# Altium schematic sheet 12-USB Phy and Hub.SchDoc
size C; SheetNumber: 12; SheetTotal: 20
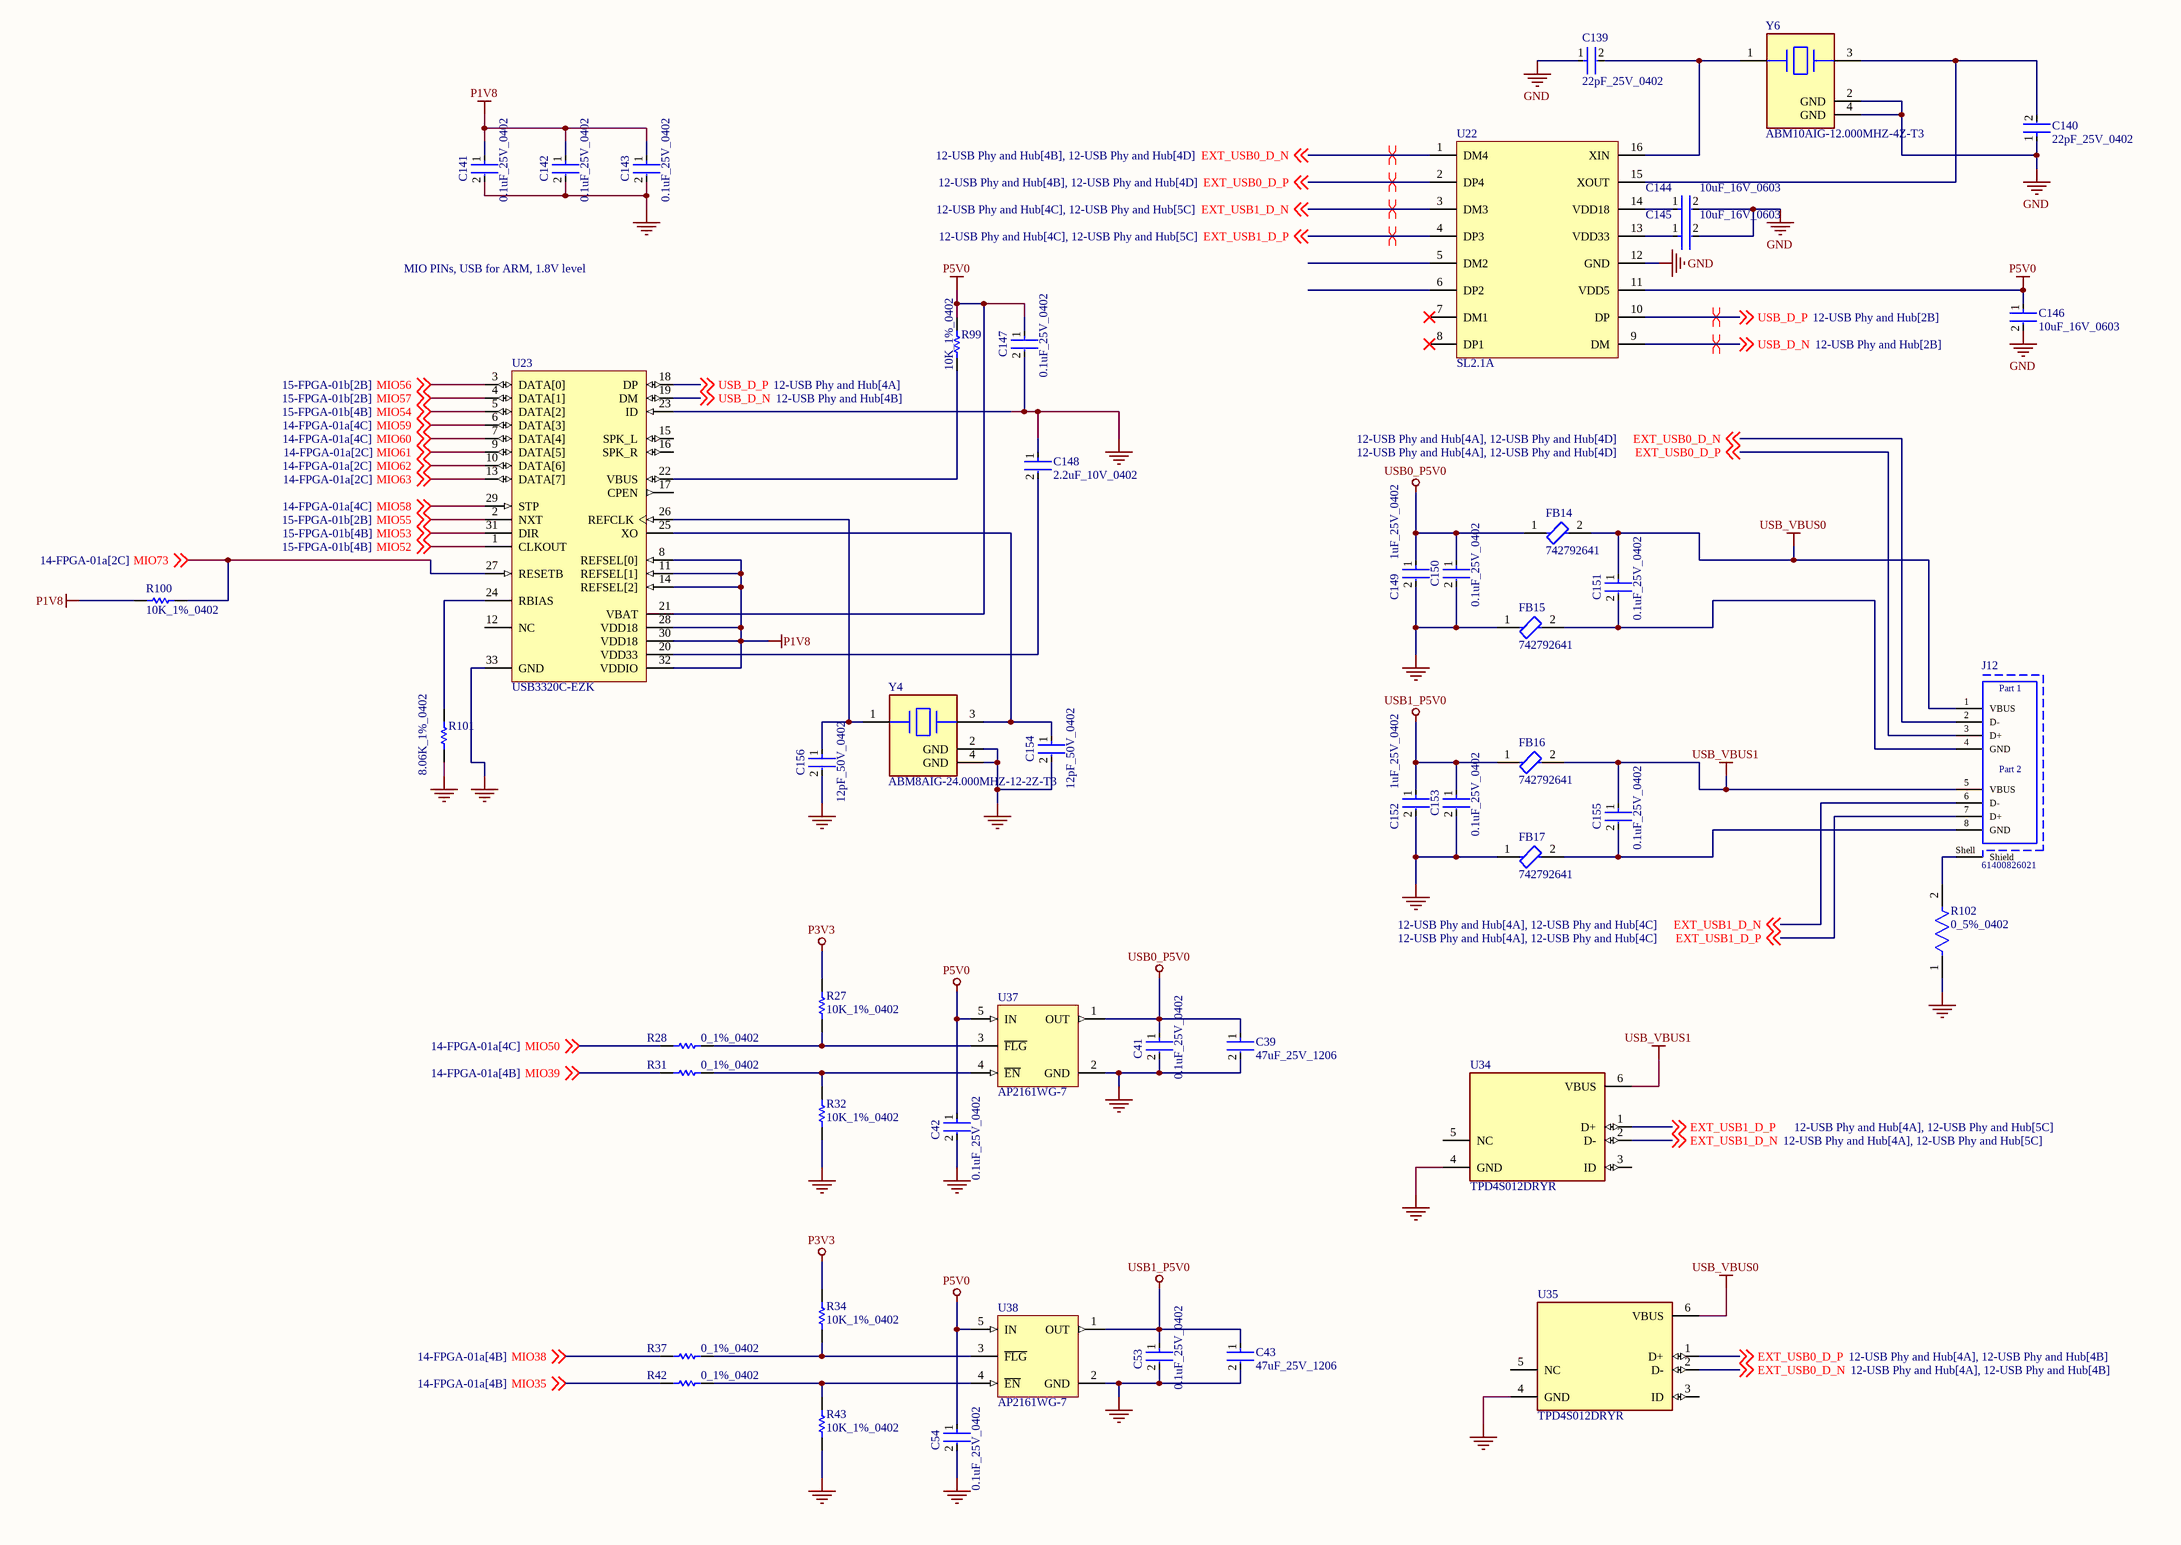
[diagram p0: 12-USB Phy and Hub.SchDoc]

## Parts
C39  47uF_25V_1206  [FP-C3216-160-0_2-MFG]
C41  0.1uF_25V_0402  [FP-0402-L_1_0_1-W_0_5_0_1-IPC_C]
C42  0.1uF_25V_0402  [FP-0402-L_1_0_1-W_0_5_0_1-IPC_C]
C43  47uF_25V_1206  [FP-C3216-160-0_2-MFG]
C53  0.1uF_25V_0402  [FP-0402-L_1_0_1-W_0_5_0_1-IPC_C]
C54  0.1uF_25V_0402  [FP-0402-L_1_0_1-W_0_5_0_1-IPC_C]
C139  22pF_25V_0402  [FP-C0402-BB-MFG]
C140  22pF_25V_0402  [FP-C0402-BB-MFG]
C141  0.1uF_25V_0402  [FP-0402-L_1_0_1-W_0_5_0_1-IPC_C]
C142  0.1uF_25V_0402  [FP-0402-L_1_0_1-W_0_5_0_1-IPC_C]
C143  0.1uF_25V_0402  [FP-0402-L_1_0_1-W_0_5_0_1-IPC_C]
C144  10uF_16V_0603  [FP-0603-L_1_6_0_2-W_0_8_0-MFG]
C145  10uF_16V_0603  [FP-0603-L_1_6_0_2-W_0_8_0-MFG]
C146  10uF_16V_0603  [FP-0603-L_1_6_0_2-W_0_8_0-MFG]
C147  0.1uF_25V_0402  [FP-0402-L_1_0_1-W_0_5_0_1-IPC_C]
C148  2.2uF_10V_0402  [FP-C1005-050-0_15-0_1-MFG]
C149  1uF_25V_0402  [FP-CL542-IPC_C]
C150  0.1uF_25V_0402  [FP-0402-L_1_0_1-W_0_5_0_1-IPC_C]
C151  0.1uF_25V_0402  [FP-0402-L_1_0_1-W_0_5_0_1-IPC_C]
C152  1uF_25V_0402  [FP-CL542-IPC_C]
C153  0.1uF_25V_0402  [FP-0402-L_1_0_1-W_0_5_0_1-IPC_C]
C154  12pF_50V_0402  [FP-0402-L_1_0_1-W_0_5_0_1-IPC_B]
C155  0.1uF_25V_0402  [FP-0402-L_1_0_1-W_0_5_0_1-IPC_C]
C156  12pF_50V_0402  [FP-0402-L_1_0_1-W_0_5_0_1-IPC_B]
FB14  742792641  [FP-742792641-MFG]
FB15  742792641  [FP-742792641-MFG]
FB16  742792641  [FP-742792641-MFG]
FB17  742792641  [FP-742792641-MFG]
J12  61400826021  [61400826021]
R27  10K_1%_0402  [RESC1005X40X25NL10T10]
R28  0_1%_0402  [RESC1005X40X25LL05T05]
R31  0_1%_0402  [RESC1005X40X25LL05T05]
R32  10K_1%_0402  [RESC1005X40X25NL10T10]
R34  10K_1%_0402  [RESC1005X40X25NL10T10]
R37  0_1%_0402  [RESC1005X40X25LL05T05]
R42  0_1%_0402  [RESC1005X40X25LL05T05]
R43  10K_1%_0402  [RESC1005X40X25NL10T10]
R99  10K_1%_0402  [RESC1005X40X25NL10T10]
R100  10K_1%_0402  [RESC1005X40X25NL10T10]
R101  8.06K_1%_0402  [RESC1005X40X25ML05T05]
R102  0_5%_0402  [FP-AC0402-0_37-IPC_B]
U22  SL2.1A  [IC_SL2.1A]
U23  USB3320C-EZK  [MCHP-QFN-32-5x5_V2]
U34  TPD4S012DRYR  [FP-DRY0006A-MFG]
U35  TPD4S012DRYR  [FP-DRY0006A-MFG]
U37  AP2161WG-7  [DIOD-SOT25-5_V]
U38  AP2161WG-7  [DIOD-SOT25-5_V]
Y4  ABM8AIG-24.000MHZ-12-2Z-T3  [FP-ABM8AIG-MFG]
Y6  ABM10AIG-12.000MHZ-4Z-T3  [FP-ABM10AIG-MFG]

## Nets
GND: C39.2 C41.2 C42.2 C43.2 C53.2 C54.2 C139.1 C140.1 C141.2 C142.2 C143.2 C144.2 C145.2 C146.2 C147.2 C148.1 C149.2 C150.2 C152.2 C153.2 C154.2 C156.2 FB15.1 FB17.1 R32.1 R43.1 R101.1 R102.1 U22.12(GND) U23.23(ID) U23.33(GND) U34.4(GND) U35.4(GND) U37.2(GND) U38.2(GND) Y4.2(GND) Y4.4(GND) Y6.2(GND) Y6.4(GND)
P1V8: C141.1 C142.1 C143.1 R100.1 U23.8(REFSEL[0]) U23.11(REFSEL[1]) U23.14(REFSEL[2]) U23.28(VDD18) U23.30(VDD18) U23.32(VDDIO)
P3V3: R27.2 R34.2
P5V0: C42.1 C54.1 C146.1 C147.1 R99.2 U22.11(VDD5) U23.21(VBAT) U37.5(IN) U38.5(IN)
USB0_P5V0: C39.1 C41.1 C149.1 C150.1 FB14.1 U37.1(OUT)
USB1_P5V0: C43.1 C53.1 C152.1 C153.1 FB16.1 U38.1(OUT)
USB_VBUS0: C151.1 FB14.2 J12.1(VBUS) U35.6(VBUS)
USB_VBUS1: C155.1 FB16.2 J12.5(VBUS) U34.6(VBUS)
EXT_USB0_D_N: J12.2(D-) U22.1(DM4) U35.2(D-) ; off-sheet EXT_USB0_D_N
EXT_USB0_D_P: J12.3(D+) U22.2(DP4) U35.1(D+) ; off-sheet EXT_USB0_D_P
EXT_USB1_D_N: J12.6(D-) U22.3(DM3) U34.2(D-) ; off-sheet EXT_USB1_D_N
EXT_USB1_D_P: J12.7(D+) U22.4(DP3) U34.1(D+) ; off-sheet EXT_USB1_D_P
MIO35: R42.1 ; off-sheet MIO35
MIO38: R37.1 ; off-sheet MIO38
MIO39: R31.1 ; off-sheet MIO39
MIO50: R28.1 ; off-sheet MIO50
MIO52: U23.1(CLKOUT) ; off-sheet MIO52
MIO53: U23.31(DIR) ; off-sheet MIO53
MIO54: U23.5(DATA[2]) ; off-sheet MIO54
MIO55: U23.2(NXT) ; off-sheet MIO55
MIO56: U23.3(DATA[0]) ; off-sheet MIO56
MIO57: U23.4(DATA[1]) ; off-sheet MIO57
MIO58: U23.29(STP) ; off-sheet MIO58
MIO59: U23.6(DATA[3]) ; off-sheet MIO59
MIO60: U23.7(DATA[4]) ; off-sheet MIO60
MIO61: U23.9(DATA[5]) ; off-sheet MIO61
MIO62: U23.10(DATA[6]) ; off-sheet MIO62
MIO63: U23.13(DATA[7]) ; off-sheet MIO63
MIO73: R100.2 U23.27(RESETB) ; off-sheet MIO73
USB_D_N: U22.9(DM) U23.19(DM) ; off-sheet USB_D_N
USB_D_P: U22.10(DP) U23.18(DP) ; off-sheet USB_D_P
NetC139_2: C139.2 U22.16(XIN) Y6.1(1_Crystal)
NetC140_2: C140.2 U22.15(XOUT) Y6.3(2_Crystal)
NetC144_1: C144.1 U22.14(VDD18)
NetC145_1: C145.1 U22.13(VDD33)
NetC148_2: C148.2 U23.20(VDD33)
NetC151_2: C151.2 FB15.2 J12.4(GND)
NetC154_1: C154.1 U23.25(XO) Y4.3
NetC155_2: C155.2 FB17.2 J12.8(GND)
NetC156_1: C156.1 U23.26(REFCLK) Y4.1
NetJ12_Shell: J12.Shell(Shield) R102.2
NetR27_1: R27.1 R28.2 U37.3(~{FLG})
NetR31_2: R31.2 R32.2 U37.4(~{EN})
NetR34_1: R34.1 R37.2 U38.3(~{FLG})
NetR42_2: R42.2 R43.2 U38.4(~{EN})
NetR99_1: R99.1 U23.22(VBUS)
NetR101_2: R101.2 U23.24(RBIAS)

Not connected (* = marked no-connect by the designer): U22 5(DM2) 6(DP2) 7(DM1)* 8(DP1)*; U23 12(NC) 15(SPK_L) 16(SPK_R) 17(CPEN); U34 3(ID) 5(NC); U35 3(ID) 5(NC)

## Layout directives
differential pair: EXT_USB0_D_N, EXT_USB0_D_P, EXT_USB1_D_N, EXT_USB1_D_P, USB_D_N, USB_D_P

## Notes on the sheet
- MIO PINs, USB for ARM, 1.8V level
- (in symbol CMP-1502-03229-1) Part 1; Part 2

## Library data of the parts
C39 C43 = CMP-2000-05397-3: Multilayer Ceramic Capacitors 47uF ±20% 25V X5R SMD 1206; Weight: 0.000571oz; Dielectric: X5R; Length: 0.126inch; Voltage Rating: 25V; Case/Package: 1206; Dielectric Material: Ceramic; Min Operating Temperature: -55°C; Lead Free: Lead Free; Packaging: Tape and Reel; Package Quantity: 1; Mount: Surface Mount; Depth: 1.6mm; REACH SVHC: No SVHC; Termination: SMD/SMT; Case Code (Imperial): 1206; Series: C; Resistor Type: Ceramic; Voltage: 25V; Width: 0.063inch; Height: 1.6mm; Tolerance: 20%; Capacitance: 47uF; Max Operating Temperature: 85°C; Voltage Rating (DC): 25V; RoHS Compliant: Yes; Thickness: 0.071inch; Case Code (Metric): 3216
C41 C42 C53 C54 C141-C143 C147 C150 C151 C153 C155 = CMP-2008-02519-2: General Purpose Ceramic Capacitor, 0402, 100nF, 10%, X7R, 15%, 25V; Package Quantity: 1; Capacitance: 100nF; Min Operating Temperature: -55°C; Voltage: 25V; Voltage Rating: 25V; Construction: Flat; Max Operating Temperature: 125°C; Radiation Hardening: No; Depth: 0.5mm; Thickness: 0.022inch; Voltage Rating (DC): 25V; Number of Pins: 2; Lead Free: Lead Free; Series: -; REACH SVHC: No SVHC; Length: 1mm; Dielectric: X7R; RoHS Compliant: Yes; Mount: Surface Mount; Packaging: Tape and Reel; Case/Package: 0402; Case Code (Imperial): 0402; Termination: SMD/SMT; Width: 0.02inch; Case Code (Metric): 1005; Tolerance: 10%
C139 C140 = CMP-2008-03308-2: CAP CER 22PF 25V 5% NP0 0402; Manufacturer: Kemet; Manufacturer Part Number: C0402C220J3GACTU; Tolerance: 0.05; Temperature Characteristic: C0G; Material: Ceramic; Temperature Coefficient: 15%; Temperature Range High: +125°C; Automotive: No; Value: 22 pF; Category: Cap; Package: C0402-BB; Voltage Rating: 25 V; ComponentLink2URL: https://content.kemet.com/datasheets/KEM_C1002_X7R_SMD.pdf; Digikey Description: CAP CER 22PF 25V 5% NP0 0402; Device Class L2: Capacitors; Height: 0.55mm; Octopart: https://octopart.com/c0402c220j3gactu-kemet-8375716; Ipc Land Pattern Name: CAPC10050X50; Capacitance: 22 pF; Temperature: -55°C to +125°C; ComponentLink2Description: Datasheet; Temperature Range Low: -55°C; Device Class L1: Passive Components; RoHS: TRUE; Lead Free: Yes; Mouser Description: Multilayer Ceramic Capacitors MLCC - SMD/SMT 25volts 22pF C0G 5%; Device Class L3: Ceramic Capacitors
C144-C146 = CMP-2000-06226-4: Multilayer Ceramic Capacitor 10uF 16V X5R 20% SMD 0603 T/R; Packaging: Tape and Reel; Construction: Flat; Height: 0.8mm; Max Operating Temperature: 85°C; Dielectric: X5R; Case Code (Metric): 1608; Voltage Rating (DC): 16V; Width: 0.031inch; Voltage Rating: 16V; Length: 0.063inch; RoHS Compliant: Yes; Halogen Free: Halogen Free; Case Code (Imperial): 0603; Capacitance: 10uF; Mount: Surface Mount; Thickness: 0.031inch; Tolerance: 20%; Min Operating Temperature: -55°C; Series: M; Termination: SMD/SMT; Case/Package: 0603; Package Quantity: 1
C148 = CMP-08246-004344-1: CAP CER 2.2UF 10V X7S 0402; Dielectric Material: Ceramic; Tolerance: 10%; Mount: Surface Mount; Height: 0.5mm; Package Quantity: 1; Depth: 0.5mm; RoHS Compliant: Yes; Length: 1mm; Thickness: 0.022inch; Packaging: Tape and Reel; Capacitance: 2.2uF; Case Code (Imperial): 0402; Resistor Type: Ceramic; Dielectric: X7S; Case/Package: 0402; Min Operating Temperature: -55°C; Voltage Rating: 10V; Series: C; Weight: 2.3E-05oz; Width: 0.02inch; Voltage Rating (DC): 10V; Case Code (Metric): 1005; Max Operating Temperature: 125°C; Termination: SMD/SMT; Lead Free: Lead Free
C149 C152 = CMP-13271-001051-1: Cap Ceramic 1uF 25V X5R ±10% SMD 0402 +85°C Paper T/R; Radiation Hardening: No; Lead Free: Lead Free; Capacitance: 1uF; Package Quantity: 10000; Max Operating Temperature: 85°C; Voltage Rating: 25V; Case/Package: 0402; Min Operating Temperature: -55°C; Packaging: Tape and Reel; Tolerance: 10%; Height: 0.5mm; Thickness: 0.022inch; Case Code (Metric): 1005; Width: 0.02inch; Case Code (Imperial): 0402; Dielectric: X5R; Length: 1mm; Mount: Surface Mount; Material: Ceramic; Depth: 0.5mm
C154 C156 = CMP-2008-02574-2: General Purpose Ceramic Capacitor, 0402, 12pF, 5%, C0G, 30ppm/°C, 50V; Insulation Resistance: 100GR; Radiation Hardening: No; RoHS Compliant: Yes; Voltage Rating: 50V; Case Code (Imperial): 0402; Height: 0.5mm; Voltage: 50V; Voltage Rating (DC): 50V; Mount: Surface Mount; Capacitance: 12pF; Thickness: 0.022inch; Depth: 0.5mm; Max Operating Temperature: 125°C; Construction: Flat; Termination: SMD/SMT; Tolerance: 5%; Length: 1mm; Lead Free: Lead Free; Dielectric: C0G; Number of Pins: 2; Package Quantity: 1; Series: -; Temperature Coefficient: 30ppm/°C; Min Operating Temperature: -55°C; Case/Package: 0402; Packaging: Tape and Reel; Case Code (Metric): 1005; Width: 0.02inch; REACH SVHC: No SVHC
FB14-FB17 = CMP-0220-00171-2: FERRITE BEAD 300 OHM 0603 1LN; Inductance: 18nH; Max DC Current: 2A; Number of Lines: 1; Test Frequency: 100MHz; Impedance: 300R; DC Resistance (DCR): 150mR; Tolerance: 25%; Case Code (Metric): 1608; Core Material: Ferrite; Length: 1.6mm; Lead Free: Lead Free; Series: WE-CBF; Min Operating Temperature: -55°C; RoHS Compliant: Yes; Case/Package: SMD/SMT; Material: Ferrite; Max Operating Temperature: 125°C; Termination: SMD/SMT; Packaging: Tape and Reel; Weight: 0.000141oz; Case Code (Imperial): 0603; Width: 0.8mm; Mount: Surface Mount; Max Current Rating: 2A; Package Quantity: 1; Depth: 0.8mm; Current Rating: 2A; Height: 0.8mm
J12 = CMP-1502-03229-1: USB 2.0 Type A Receptacle WR-COM, Stacked Horizontal, THT; Manufacturer: Wurth Elektronik; Contact Resistance: 20mOhm; Rated Current: 1.5A; Working Voltage: 30VAC; Connector Type: USB2.0TypeA; Packaging: Tray; Package Reference: 61400826021; Mounting Technology: THT; Datasheet URL: https://katalog.we-online.de/em/datasheet/61400826021.pdf; Operating Temperature: -40to105degC; Gender: Receptacle; Orientation: StackedHorizontal; Part Number: 61400826021; Publisher: WurthElektronik; Manufacturer URL: http://www.we-online.de
R27 R32 R34 R43 R99 R100 = CMP-2002-04694-1: Manufacturer: Bourns; Part Number: CR0402-FX-1002GLF
R28 R31 R37 R42 = CMP-2000-07451-1: Chip Resistor, 0 Ohm, 0.1 W, -55 to 155 degC, 0402 (1005 Metric), RoHS, Tape and Reel; Manufacturer: Panasonic; Voltage Rating (DC): 50V; Temperature Coefficient: 600ppm/��C; Max Power Dissipation: 100mW; Resistance: 0mOhm; Tolerance: 5%; Number of Terminations: 2; Mount: SurfaceMount; Height: 0.35mm; Packaging: TapeandReel; Contact Plating: Tin; Manufacturer URL: http://www.panasonic.com/; Composition: ThickFilm; Max Operating Temperature: 155degC; REACH SVHC: NoSVHC; Case/Package: 0402; Package Reference: 402; Depth: 0.5mm; Package Description: 2-Pin Surface Mount Device, Body 1 x 0.5 mm; Datasheet URL: https://industrial.panasonic.com/cdbs/www-data/pdf/RDA0000/AOA0000C301.pdf; RoHSCompliant: True; Case Code (Imperial): 0402; Military Standard: Not; Min Operating Temperature: -55degC; Power Rating: 100mW; Datasheet Version: 03/2015; Length: 1mm; Case Code (Metric): 1005; Termination: SMD/SMT; Mounting Technology: SurfaceMount; Voltage Rating: 50V; Width: 0.02inch; Package Quantity: 1; Lead Free: LeadFree; Radiation Hardening: No
R101 = CMP-2002-00253-3: Chip Resistor, 8.06 KOhm, +/- 1%, 63 mW, -55 to 155 degC, 0402 (1005 Metric), RoHS, Tape and Reel; PartNumber: CRCW04028K06FKED; Manufacturer: Basic Passives; Case\/Package: 0402; Power Rating: 63 mW; Voltage Rating: 50 V; PackageReference: 0402; Radiation Hardening: No; Package Quantity: 10000; Height: 0.35 mm; Packaging: Tape and Reel; Mount: Surface Mount; Length: 1 mm; Weight: 2.3E-05oz; Case Code (Metric): 1005; DatasheetVersion: 06/2012; Pins: 2; Min Operating Temperature: -55 degC; Case Code (Imperial): 0402; REACH SVHC: Unknown; Tolerance: 1%; Mounting Technology: Surface Mount; ComponentLink1URL: http://www.vishay.com/; ComponentLink2URL: http://www.vishay.com/docs/20035/dcrcwe3.pdf; ComponentLink2Description: Datasheet; Resistance: 8.06 KOhm; Max Operating Temperature: 155 degC; ComponentLink1Description: Manufacturer URL; Width: 0.5 mm; RoHSCompliant: true; PackageDescription: 2-Pin Surface Mount Device, Body 1 x 0.5 mm
R102 = CMP-2002-01772-2: RESISTOR 0402 JUMPER ZERO OHM; Voltage Rating: 50V; Temperature Coefficient: 200ppm/°C; Tolerance: 1%; Power Rating: 62.5mW; Resistance: 0R; Min Operating Temperature: -55°C; Termination: SMD/SMT; Case/Package: 0402; Case Code (Imperial): 0402; Packaging: Tape and Reel; Case Code (Metric): 1005; Max Operating Temperature: 155°C; Series: AC
U22 = IC_SL2.1A: USB 2.0 HIGH SPEED 4-PORT HUB CONTROLLER; MF: CoreChips ShenZhen CO.,Ltd; Check_prices: https://www.snapeda.com/parts/SL2.1A/CoreChips%20ShenZhen%20CO.,Ltd/view-part/4219225/?ref=eda; Price: None; Availability: No availability data; Value: *; SnapEDA_Link: https://www.snapeda.com/parts/SL2.1A/CoreChips%20ShenZhen%20CO.,Ltd/view-part/4219225/?ref=snap; MP: SL2.1A; Package: Package; Supplier 1: LCSC; Supplier Part Number 1: C192893
U23 = CMP-0186-00335-1: Highly Integrated Full Featured Hi-Speed USB 2.0 ULPI Transceiver, 1.8 to 3.3 V, -40 to 85 degC, 32-Pin QFN (QFN-3304), RoHS, Tray; Manufacturer: Microchip; VVBAT: 3.1 to 5.5 V; REFCLK Frequency@ULPI Input Clock Mode: 60 MHz; Cpin: 4 pF Max.; VDD33: 3 to 3.6 V; Mounting Technology: Surface Mount; I/O Voltage: 1.8 to 3.3 V; ComponentLink3URL: http://ww1.microchip.com/downloads/en/DeviceDoc/00001792A.pdf; PackageDescription: 32-Pin Quad Flat Non-Leaded Package, Body 5 x 5 mm, Pitch 0.5 mm; ComponentLink2URL: http://ww1.microchip.com/downloads/en/DeviceDoc/00001792A.pdf; Temperature Range: -40 to 85 degC; ComponentLink2Description: Datasheet; ComponentLink1URL: www.microchip.com/; ComponentLink3Description: Package Specification; Packing: Tray; ComponentLink1Description: Manufacturer URL; PartNumber: USB3320C-EZK; PackageVersion: Rev. H; DatasheetVersion: DS00001792A; RoHS: TRUE
U34 U35 = CMP-0326-00038-4: TVS DIODE 5.5V 6SON; Breakdown Voltage: 24V; Interface: USB; ESD Protection: Yes; Peak Pulse Power: 60W; Number of Circuits: 4; Polarity: Unidirectional; Capacitance: 15pF; Test Current: 1mA; Working Voltage: 19V; Min Breakdown Voltage: 6V; Peak Pulse Current: 3A; Operating Supply Voltage: 950mV; Max Operating Temperature: 85°C; Packaging: Tape and Reel; Termination: SMD/SMT; Number of Pins: 6; Radiation Hardening: No; Width: 1.05mm; REACH SVHC: No SVHC; Lead Free: Lead Free; Depth: 1mm; Package Quantity: 5000; Length: 1.45mm; Direction: Unidirectional; Min Operating Temperature: -40°C; Number of Channels: 4; Max Power Dissipation: 60W; Height: 0.55mm
U37 U38 = CMP-2000-05781-1: Single Channel Current-limited Power Switch / , 1 A, 2.7 to 5.5 V, -40 to 85 degC, 5-Pin SOT25, RoHS, Tape and Reel; Manufacturer: Diodes-Incorporated; Voltage - Supply (Vcc/Vdd): NotRequired; Interface: On/Off; Ratio - Input: Output:1:1; Input Type: Non-Inverting; Fault Protection: CurrentLimiting(Fixed),OverTemperature,ReverseCurrent,UVLO; Voltage - Load: 2.7V~5.5V; Number of Outputs: 1; Current - Output (Max): 1A; Output Configuration: HighSide; Output Type: P-Channel; Rds On (Typ): 95mOhm; Switch Type: USBSwitch; Family: PMIC-PowerDistributionSwitches,LoadDrivers; Package Reference: SOT25-5; Operating Temperature: -40°C~85°C(TA); Category: IntegratedCircuits(ICs); Datasheet URL: https://www.diodes.com/assets/Datasheets/AP2161_71.pdf; Manufacturer URL: http://www.diodes.com/; Package Description: 5-Pin Small Outline Transistor, Body 3 x 1.6 mm, Pitch 0.95 mm; Mounting Technology: SurfaceMount; Packaging: Tape&Reel(TR); Datasheet Version: Rev. 9-2, 08/2015; Supplier Device Package: SOT-25; Package / Case: SC-74A,SOT-753; Features: StatusFlag; Series: -
Y4 = CMP-27762-015716-1: Crystal 24MHz ±20ppm (Tol) ±50ppm (Stability) 12pF FUND 50Ω Automotive 4-Pin Ultra Mini-CSMD T/R; ESR (Equivalent Series Resistance): 50R; Series: ABM8AIG; RoHS Compliant: Yes; Load Capacitance: 12pF; Height: 0.031inch; Min Operating Temperature: -40°C; Mount: Surface Mount; Packaging: Cut Tape; Ratings: AEC-Q200; Case/Package: SMD/SMT; Frequency Stability: 50ppm; Max Operating Temperature: 125°C; Length: 0.126inch; Frequency: 24MHz; Frequency Tolerance: 20ppm; Width: 0.098inch
Y6 = CMP-27762-011014-1: Crystal 12MHz ±30ppm 10pF SMD-4 2.5mm x 2mm Automotive; Frequency Stability: 50ppm; ESR (Equivalent Series Resistance): 150R; Max Operating Temperature: 125°C; Frequency Tolerance: 30ppm; Frequency: 12MHz; RoHS Compliant: Yes; Mount: Surface Mount; Packaging: Tape and Reel; Case/Package: SMD/SMT; Load Capacitance: 10pF; Min Operating Temperature: -40°C; Length: 0.098inch; Height: 0.024inch; Width: 0.079inch; Ratings: AEC-Q200